# Altium schematic sheet ZIGBEE.SchDoc
size A3
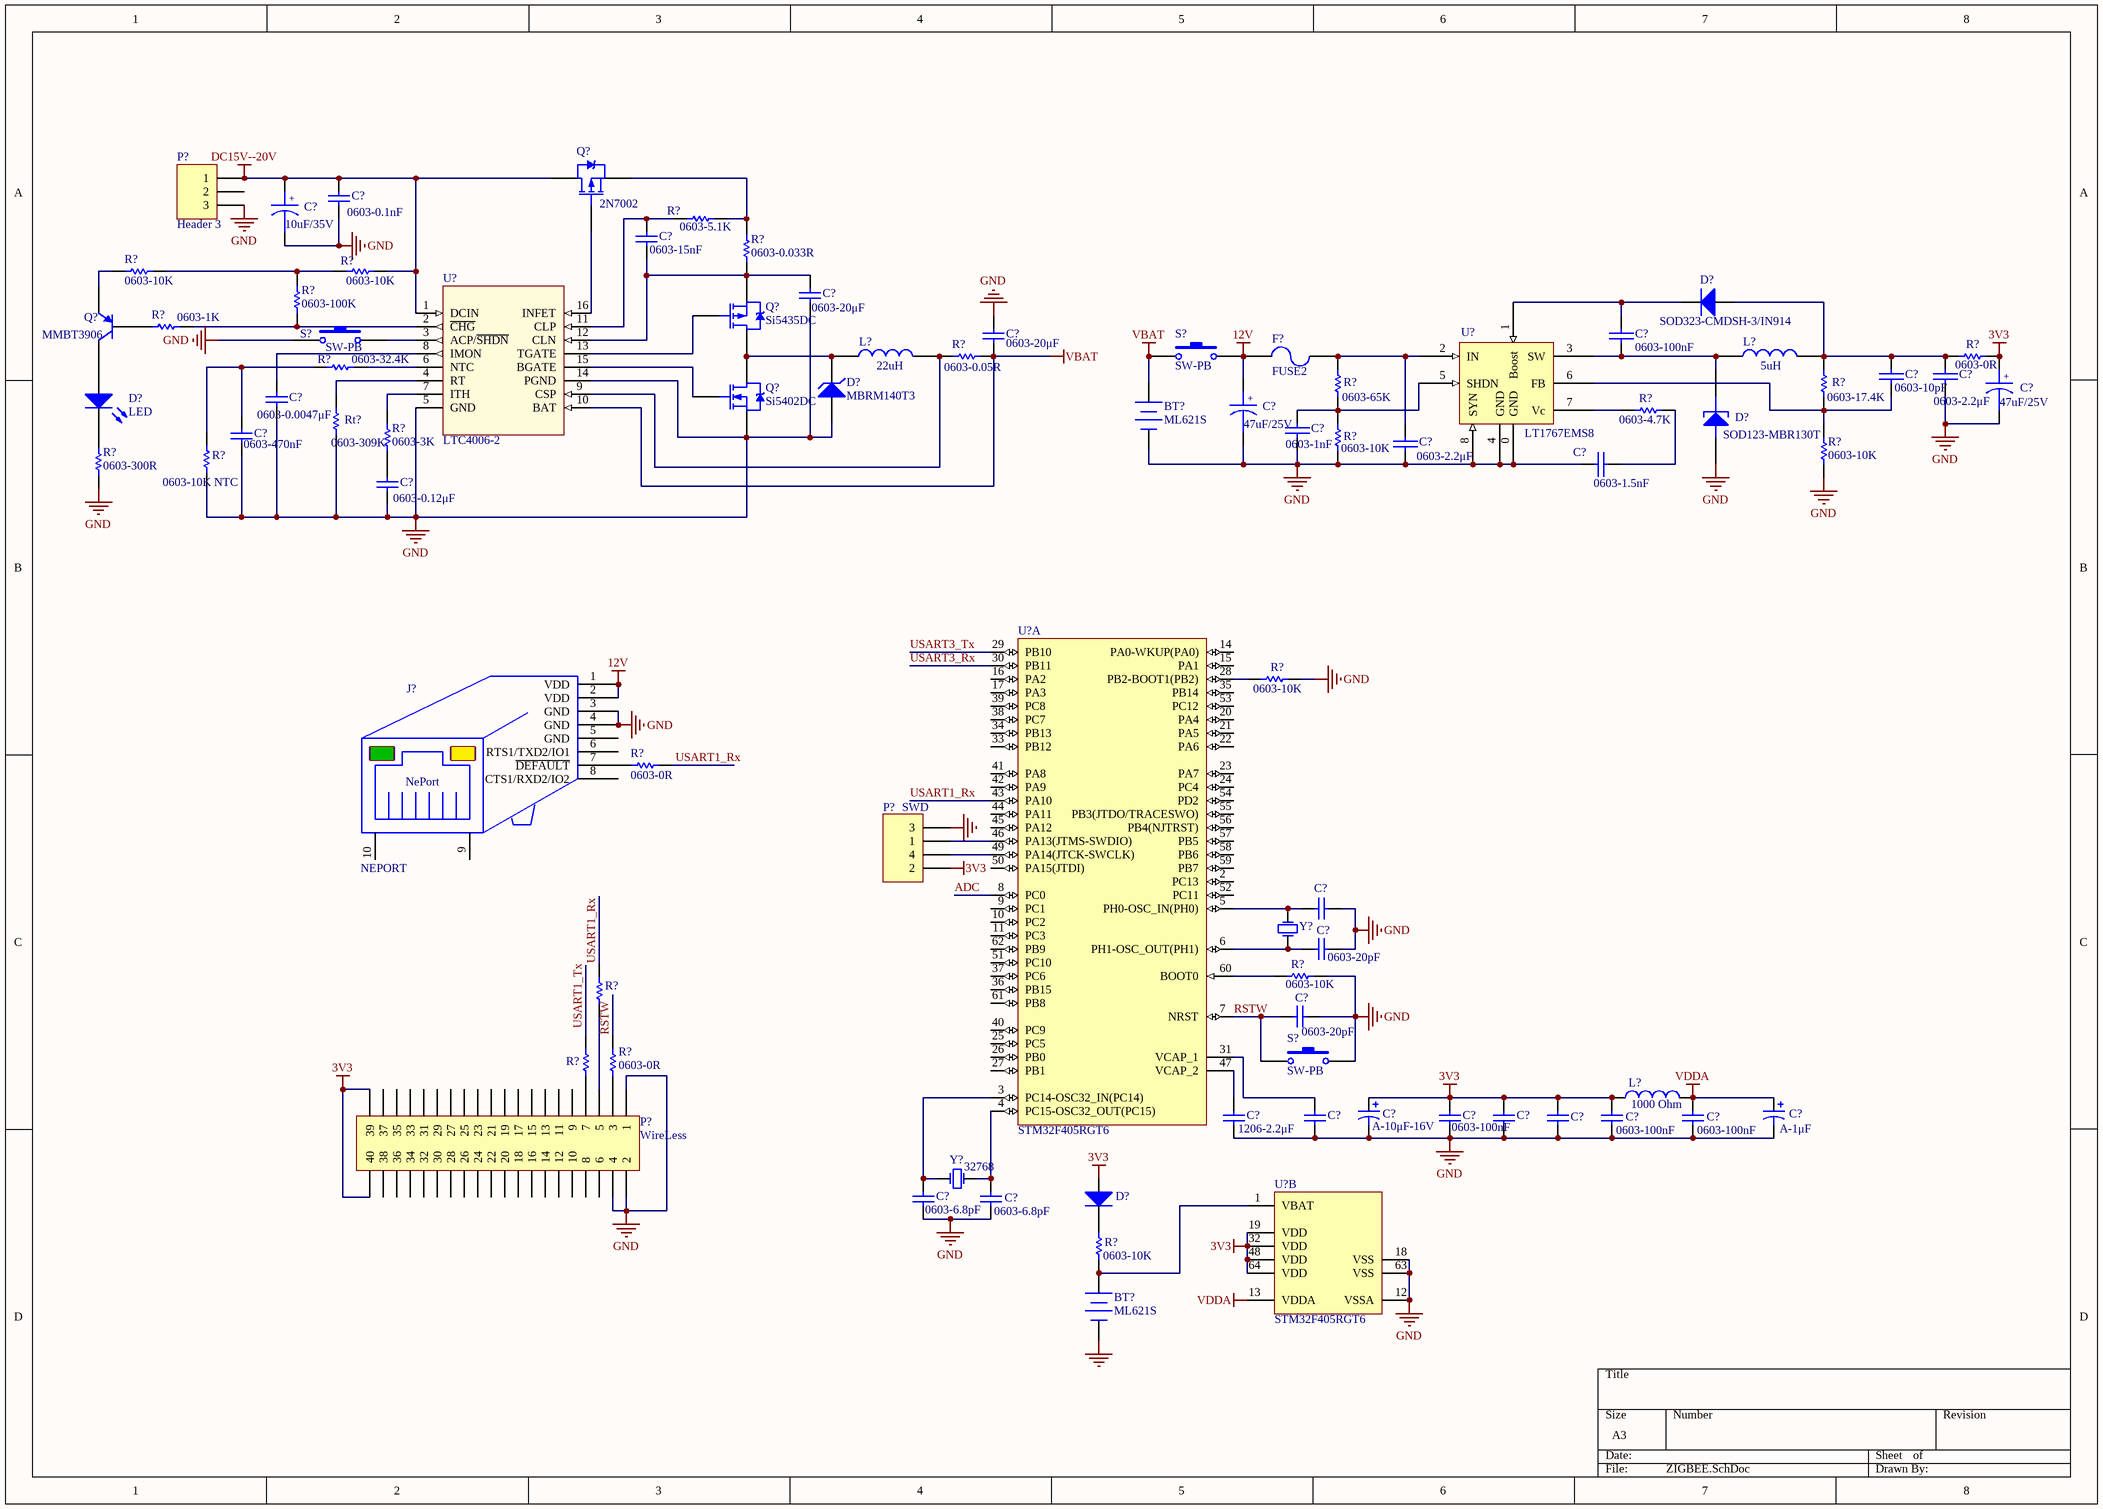
[diagram p0: ZIGBEE.SchDoc]

## Parts
(Parts that share a designator on the sheet are numbered #1, #2 ... from top to bottom, then left to right.)
BT?#1  ML621S  [ML621]
BT?#2  ML621S  [ML621]
C?#1  10uF/35V  [SMD-47uF/25V]
C?#2  0603-0.1nF  [0603C]
C?#3  0603-15nF  [0603C]
C?#4  0603-20μF  [0603C]
C?#5  0603-20μF  [0603C]
C?#6  0603-100nF  [0603C]
C?#7  0603-10pF  [0603C]
C?#8  0603-2.2μF  [0603C]
C?#9  47uF/25V  [SMD-47uF/25V]
C?#10  0603-0.0047μF  [0603C]
C?#11  47uF/25V  [SMD-47uF/25V]
C?#12  0603-1nF  [0603C]
C?#13  0603-470nF  [0603C]
C?#14  0603-2.2μF  [0603C]
C?#15  0603-0.12μF  [0603C]
C?#16  0603-1.5nF  [0603C]
C?#17  0603-20pF  [0603C]  (value not drawn)
C?#18  0603-20pF  [0603C]
C?#19  0603-20pF  [0603C]
C?#20  A-10μF-16V  [TANA]
C?#21  A-1μF  [TANA]
C?#22  1206-2.2μF  [1206C]
C?#23  1206-2.2μF  [1206C]  (value not drawn)
C?#24  0603-100nF  [0603C]
C?#25  0603-100nF  [0603C]  (value not drawn)
C?#26  0603-100nF  [0603C]  (value not drawn)
C?#27  0603-100nF  [0603C]
C?#28  0603-100nF  [0603C]
C?#29  0603-6.8pF  [0603C]
C?#30  0603-6.8pF  [0603C]
D?#1  SOD323-CMDSH-3/IN914  [SOD-323]
D?#2  LED  [LED-0]
D?#3  MBRM140T3  [DIODE-0.7]
D?#4  SOD123-MBR130T  [SOD123/X.85]
D?#5  1N4148  [SOD-80/MLL34]  (value not drawn)
F?  FUSE2  [0603]
J?  NEPORT  [RJ45_8P8C]
L?#1  22uH  [CDRH3D16]
L?#2  5uH  [CDRH3D16]
L?#3  1000 Ohm  [INDC4516AM]
P?#1  Header 3  [HDR1X3]
P?#2  SWD  [HDR1X4]
P?#3  WireLess  [SMALL/MIDDLE OEM MODEM]
Q?#1  2N7002  [TO-220AB]
Q?#2  MMBT3906  [TO-92A]
Q?#3  Si5435DC  [TO-220AB]
Q?#4  Si5402DC  [TO-220AB]
R?#1  0603-5.1K  [0603]
R?#2  0603-0.033R  [0603]
R?#3  0603-10K  [0603]
R?#4  0603-10K  [0603]
R?#5  0603-100K  [0603]
R?#6  0603-1K  [0603]
R?#7  0603-0.05R  [0603]
R?#8  0603-0R  [0603]
R?#9  0603-32.4K  [0603]
R?#10  0603-65K  [0603]
R?#11  0603-17.4K  [0603]
R?#12  0603-3K  [0603]
R?#13  0603-4.7K  [0603]
R?#14  0603-10K NTC  [0603]
R?#15  0603-10K  [0603]
R?#16  0603-10K  [0603]
R?#17  0603-300R  [0603]
R?#18  0603-10K  [0603]
R?#19  0603-0R  [0603]
R?#20  0603-10K  [0603]
R?#21  0603-0R  [0603]  (value not drawn)
R?#22  0603-0R  [0603]  (value not drawn)
R?#23  0603-0R  [0603]
R?#24  0603-10K  [0603]
Rt?  0603-309K  [0603]
S?#1  SW-PB  [SW3*4*2MM]
S?#2  SW-PB  [SW3*4*2MM]
S?#3  SW-PB  [SW3*4*2MM]
U?#1  LTC4006-2  [SSOP-16-M]
U?#2  LT1767EMS8  [MS8_N]
U?#3  STM32F405RGT6  [TQFP64_M]  (part A of 2)
U?#4  STM32F405RGT6  [TQFP64_M]  (part B of 2)
Y?#1  8MHz  [XTAL]  (value not drawn)
Y?#2  32768  [1206CY]

## Nets
3V3: C?#9.1 C?#20.1 C?#24.2 C?#25.2 C?#26.2 C?#27.2 D?#5.1(A) L?#3.1 P?#2.2 P?#3.39 P?#3.40 R?#8.2 U?#4.19(VDD) U?#4.32(VDD) U?#4.48(VDD) U?#4.64(VDD)
12V: C?#11.1 F?.1 J?.1(VDD) J?.2(VDD) S?#2.2
DC15V--20V: C?#1.1 C?#2.1 P?#1.1 Q?#1.2(D) R?#4.2 U?#1.1(DCIN)
GND: BT?#1.1(-) BT?#2.1(-) C?#1.2 C?#2.2 C?#4.2 C?#5.1 C?#8.2 C?#9.2 C?#10.2 C?#11.2 C?#12.2 C?#13.2 C?#14.2 C?#15.2 C?#16.1 C?#17.1 C?#18.1 C?#19.1 C?#20.2 C?#21.2 C?#22.1 C?#23.1 C?#24.1 C?#25.1 C?#26.1 C?#27.1 C?#28.1 C?#29.2 C?#30.2 D?#3.1(A) D?#4.1(A) J?.3(GND) J?.4(GND) P?#1.3 P?#2.3 P?#3.1 P?#3.2 P?#3.4 Q?#4.3(S) R?#14.2 R?#15.1 R?#16.1 R?#17.1 R?#18.2 R?#20.2 Rt?.2 S?#1.1 S?#3.2 U?#1.5(GND) U?#1.14(PGND) U?#2.0(GND) U?#2.4(GND) U?#2.8(SYN) U?#4.12(VSSA) U?#4.18(VSS) U?#4.63(VSS)
VBAT: BT?#1.2(+) C?#5.2 R?#7.2 S?#2.1 U?#1.10(BAT)
VDDA: C?#21.1 C?#28.2 L?#3.2 U?#4.13(VDDA)
ADC: U?#3.8(PC0)
RSTW: C?#19.2 R?#23.1 S?#3.1 U?#3.7(NRST)
USART1_Rx: R?#19.1 R?#21.1 U?#3.43(PA10)
USART1_Tx: R?#22.1
USART3_Rx: U?#3.30(PB11)
USART3_Tx: U?#3.29(PB10)
NetBT?#2_2: BT?#2.2(+) R?#24.2 U?#4.1(VBAT)
NetC?#3_1: C?#3.1 R?#1.2 U?#1.11(CLP)
NetC?#3_2: C?#3.2 C?#4.1 Q?#3.3(S) R?#2.2 U?#1.12(CLN)
NetC?#6_1: C?#6.1 D?#1.2(K) U?#2.1(Boost)
NetC?#6_2: C?#6.2 D?#4.2(K) L?#2.1 U?#2.3(SW)
NetC?#7_1: C?#7.1 C?#8.1 D?#1.1(A) L?#2.2 R?#8.1 R?#11.2
NetC?#7_2: C?#7.2 R?#11.1 R?#16.2 U?#2.6(FB)
NetC?#10_1: C?#10.1 U?#1.8(IMON)
NetC?#12_1: C?#12.1 R?#10.1 R?#15.2 U?#2.5(SHDN)
NetC?#13_1: C?#13.1 R?#9.2 R?#14.1
NetC?#14_1: C?#14.1 F?.2 R?#10.2 U?#2.2(IN)
NetC?#15_1: C?#15.1 R?#12.2
NetC?#16_2: C?#16.2 R?#13.1
NetC?#17_2: C?#17.2 U?#3.5(PH0-OSC_IN(PH0)) Y?#1.2(OSC2)
NetC?#18_2: C?#18.2 U?#3.6(PH1-OSC_OUT(PH1)) Y?#1.1(OSC1)
NetC?#22_2: C?#22.2 U?#3.47(VCAP_2)
NetC?#23_2: C?#23.2 U?#3.31(VCAP_1)
NetC?#29_1: C?#29.1 U?#3.3(PC14-OSC32_IN(PC14)) Y?#2.2(OSC2)
NetC?#30_1: C?#30.1 U?#3.4(PC15-OSC32_OUT(PC15)) Y?#2.1(OSC1)
NetD?#2_1: D?#2.1(A) Q?#2.3(C)
NetD?#2_2: D?#2.2(K) R?#17.2
NetD?#3_2: D?#3.2(K) L?#1.1 Q?#3.2(D) Q?#4.2(D)
NetD?#5_2: D?#5.2(K) R?#24.1
NetJ?_7: J?.7(~{DEFAULT}) R?#19.2
NetL?#1_2: L?#1.2 R?#7.1 U?#1.9(CSP)
NetP?#2_1: P?#2.1 U?#3.46(PA13(JTMS-SWDIO))
NetP?#2_4: P?#2.4 U?#3.49(PA14(JTCK-SWCLK))
NetP?#3_3: P?#3.3 R?#23.2
NetP?#3_5: P?#3.5 R?#21.2
NetP?#3_7: P?#3.7 R?#22.2
NetQ?#1_1: Q?#1.1(G) U?#1.16(INFET)
NetQ?#1_3: Q?#1.3(S) R?#1.1 R?#2.1
NetQ?#2_1: Q?#2.1(E) R?#3.1
NetQ?#2_2: Q?#2.2(B) R?#6.1
NetQ?#3_1: Q?#3.1(G) U?#1.13(TGATE)
NetQ?#4_1: Q?#4.1(G) U?#1.15(BGATE)
NetR?#3_2: R?#3.2 R?#4.1 R?#5.1
NetR?#5_2: R?#5.2 R?#6.2 U?#1.2(~{CHG})
NetR?#9_1: R?#9.1 U?#1.6(NTC)
NetR?#12_1: R?#12.1 U?#1.7(ITH)
NetR?#13_2: R?#13.2 U?#2.7(Vc)
NetR?#18_1: R?#18.1 U?#3.28(PB2-BOOT1(PB2))
NetR?#20_1: R?#20.1 U?#3.60(BOOT0)
NetRt?_1: Rt?.1 U?#1.4(RT)
NetS?#1_2: S?#1.2 U?#1.3(ACP/~{SHDN})

Not connected (* = marked no-connect by the designer): J? 5(GND) 6(RTS1/TXD2/IO1) 8(CTS1/RXD2/IO2) 9(SHELL) 10(SHELL); P?#1 2; P?#3 6 8 9 10 11 12 13 14 15 16 17 18 19 20 21 22 23 24 25 26 27 28 29 30 31 32 33 34 35 36 37 38; U?#3 2(PC13) 9(PC1) 10(PC2) 11(PC3) 14(PA0-WKUP(PA0)) 15(PA1) 16(PA2) 17(PA3) 20(PA4) 21(PA5) 22(PA6) 23(PA7) 24(PC4) 25(PC5) 26(PB0) 27(PB1) 33(PB12) 34(PB13) 35(PB14) 36(PB15) 37(PC6) 38(PC7) 39(PC8) 40(PC9) 41(PA8) 42(PA9) 44(PA11) 45(PA12) 50(PA15(JTDI)) 51(PC10) 52(PC11) 53(PC12) 54(PD2) 55(PB3(JTDO/TRACESWO)) 56(PB4(NJTRST)) 57(PB5) 58(PB6) 59(PB7) 61(PB8) 62(PB9)

## Notes on the sheet
- (in symbol NEPORT) NePort
- (in symbol 电解电容) +

## Library data of the parts
BT?#1 BT?#2 = Battery: Multicell Battery; Published: 24-Mar-1999; LatestRevisionDate: 17-Jul-2002; LatestRevisionNote: Re-released for DXP Platform.; PackageReference: BAT-2; Publisher: Altium Limited
C?#1 C?#9 C?#11 = 电解电容: Capacitor
C?#2-C?#5 C?#10 C?#13 C?#15 C?#17-C?#19 C?#22-C?#30 = Cap: Capacitor; Published: 8-Jun-2000; LatestRevisionDate: 17-Jul-2002; LatestRevisionNote: Re-released for DXP Platform.; PackageReference: RAD-0.3; Publisher: Altium Limited; PackageDescription: Radial Cap, Thru-Hole; 2 Leads; 0.3 in Pin Spacing
  C?#2: Value: 0603-0.1nF
  C?#3: Value: 0603-15nF
  C?#4 C?#5: Value: 0603-20μF
  C?#10: Value: 0603-0.0047μF
  C?#13: Value: 0603-470nF
  C?#15: Value: 0603-0.12μF
  C?#17-C?#19: Value: 0603-20pF
  C?#22 C?#23: Value: 1206-2.2μF
  C?#24-C?#28: Value: 0603-100nF
  C?#29 C?#30: Value: 0603-6.8pF
C?#6-C?#8 C?#12 C?#14 C?#16 = 普通电容: Capacitor
C?#20 = Cap Pol1: Polarized Capacitor (Radial); Published: 8-Jun-2000; LatestRevisionDate: 17-Jul-2002; LatestRevisionNote: Re-released for DXP Platform.; PackageReference: RB7.6-15; Publisher: Altium Limited; PackageDescription: Polarized Capacitor (Radial); 2 Leads; Value: A-10μF-16V
C?#21 = Cap Pol1: Polarized Capacitor (Radial); Value: 1μF; Published: 8-Jun-2000; LatestRevisionDate: 17-Jul-2002; LatestRevisionNote: Re-released for DXP Platform.; PackageReference: RB7.6-15; Publisher: Altium Limited; PackageDescription: Polarized Capacitor (Radial); 2 Leads
D?#1 = DIODE
D?#2 = LED0: Typical INFRARED GaAs LED; Published: 8-Jun-2000; LatestRevisionDate: 08-Jul-2005; LatestRevisionNote: Mech Layer 1 removed.; PackageReference: LED-0; Publisher: Altium Limited
D?#3 = D Zener: Zener Diode; Published: 8-Jun-2000; LatestRevisionDate: 17-Jul-2002; LatestRevisionNote: Re-released for DXP Platform.; PackageReference: DIODE-0.7; Publisher: Altium Limited
D?#4 = TUNNEL: Tunnel FDiode
D?#5 = Diode 1N4148: High Conductance Fast Diode; Published: 8-Jun-2000; LatestRevisionDate: 17-Jul-2002; LatestRevisionNote: Re-released for DXP Platform.; DatasheetVersion: 1997; PackageReference: DO-35; Publisher: Altium Limited; PackageDescription: Diode, Axial; Body 3.8 x 1.9 mm (LxDia. max), Lead Dia. 0.53 mm (max); Code_JEDEC: DO-204-AH; ComponentLink1Description: Manufacturer Link; ComponentLink1URL: http://www.fairchildsemi.com/; ComponentLink2Description: Datasheet; ComponentLink2URL: http://www.fairchildsemi.com/ds/1N%2F1N4148.pdf
F? = FUSE2: Fuse
J? = NEPORT: serial to ethernet RJ45 jack
L?#1 L?#2 = INDUCTOR
L?#3 = Inductor: BLM41PG102SN1L\CBW451616U900; Code_IEC: 1005; Published: 8-Jun-2000; LatestRevisionDate: 29-May-2009; LatestRevisionNote: IPC-7351 Footprint Added.; PackageReference: 0402-A; Publisher: Altium Limited; PackageDescription: Chip Inductor; Code_JEITA: 0402; Value: 1000 Ohm
P?#1 = Header 3: Header, 3-Pin; LatestRevisionDate: 17-Jul-2002; LatestRevisionNote: Re-released for DXP Platform.; Publisher: Altium Limited
P?#2 = Header 4: Header, 4-Pin; LatestRevisionDate: 17-Jul-2002; LatestRevisionNote: Re-released for DXP Platform.; Publisher: Altium Limited
P?#3 = Header 20X2: Header, 20-Pin, Dual row; LatestRevisionDate: 17-Jul-2002; LatestRevisionNote: Re-released for DXP Platform.; Publisher: Altium Limited
Q?#1 Q?#3 = PMOS-2: P-Channel Power MOSFET; Note: Pin 4 not drawn and electrically connected to Pin 2.; Published: 8-Jun-2000; LatestRevisionDate: 17-Jul-2002; LatestRevisionNote: Re-released for DXP Platform.; DatasheetDocument: PD-9.390D; PackageReference: TO-220AB; Publisher: Altium Limited; Code_JEDEC: TO-220-AB; ComponentLink1Description: Manufacturer Link; ComponentLink1URL: http://www.irf.com/
Q?#2 = 2N3906: PNP General Purpose Amplifier; Published: 8-Jun-2000; LatestRevisionDate: 15-Jan-2003; LatestRevisionNote: PCB Footprint 'BCY-W3/D4.7' replaced; DatasheetDocument: 1997; PackageDocument: Sep-1998; PackageReference: TO-92A; Publisher: Altium Limited; Code_JEDEC: TO-92A; ComponentLink1Description: Manufacturer Link; ComponentLink1URL: http://www.fairchildsemi.com/; ComponentLink2Description: Datasheet; ComponentLink2URL: http://www.fairchildsemi.com/ds/2N%2F2N3906.pdf
Q?#4 = NMOS-2: N-Channel Power MOSFET; Note: Pin 2 is electrically connected to pin 4.; Published: 8-Jun-2000; LatestRevisionDate: 17-Jul-2002; LatestRevisionNote: Re-released for DXP Platform.; DatasheetDocument: PD-9.814; PackageReference: TO-220AB; Publisher: Altium Limited; Code_JEDEC: TO-220-AB; ComponentLink1Description: Manufacturer Link; ComponentLink1URL: http://www.irf.com/
R?#1-R?#6 R?#9 R?#12 R?#14 R?#19 R?#21-R?#23 Rt? = Res1: Resistor; Rule: PcbType=ProtelPcb; Published: 8-Jun-2000; LatestRevisionDate: 17-Jul-2002; LatestRevisionNote: Re-released for DXP Platform.; PackageReference: AXIAL-0.3; Publisher: Altium Limited; PackageDescription: Axial Device, Thru-Hole; 2 Leads; 0.3 in Pin Spacing
  R?#1: Value: 0603-5.1K
  R?#2: Value: 0603-0.033R
  R?#3 R?#4 R?#14: Value: 0603-10K
  R?#5: Value: 0603-100K
  R?#6: Value: 0603-1K
  R?#9: Value: 0603-32.4K
  R?#12: Value: 0603-3K
  R?#19 R?#21-R?#23: Value: 0603-0R
  Rt?: Value: 0603-309K
R?#7 = Res1: Resistor; Value: 0603-0.025R; Rule: PcbType=ProtelPcb; Published: 8-Jun-2000; LatestRevisionDate: 17-Jul-2002; LatestRevisionNote: Re-released for DXP Platform.; PackageReference: AXIAL-0.3; Publisher: Altium Limited; PackageDescription: Axial Device, Thru-Hole; 2 Leads; 0.3 in Pin Spacing
R?#8 R?#10 R?#11 R?#13 R?#15 R?#16 R?#18 R?#20 R?#24 = Res1: Resistor; Published: 8-Jun-2000; LatestRevisionDate: 17-Jul-2002; LatestRevisionNote: Re-released for DXP Platform.; PackageReference: AXIAL-0.3; Publisher: Altium Limited; PackageDescription: Axial Device, Thru-Hole; 2 Leads; 0.3 in Pin Spacing
  R?#8: Value: 0603-0R
  R?#10: Value: 0603-65K
  R?#11: Value: 0603-17.4K
  R?#13: Value: 0603-4.7K
  R?#15 R?#16 R?#18 R?#20 R?#24: Value: 0603-10K
R?#17 = Res1: Resistor; Value: 0603-100K; Rule: PcbType=ProtelPcb; Published: 8-Jun-2000; LatestRevisionDate: 17-Jul-2002; LatestRevisionNote: Re-released for DXP Platform.; PackageReference: AXIAL-0.3; Publisher: Altium Limited; PackageDescription: Axial Device, Thru-Hole; 2 Leads; 0.3 in Pin Spacing
S?#1-S?#3 = SW-PB: Switch; Published: 24-Mar-1999; LatestRevisionDate: 17-Jul-2002; LatestRevisionNote: Re-released for DXP Platform.; PackageReference: SPST-2; Publisher: Altium Limited
U?#1 = LTC4006
U?#3 U?#4 = STM32F405RGT6: ARM Cortex-M4 32-bit MCU+FPU, 210 DMIPS, 1024 kB Flash, 192 kB Internal RAM, 51 I/Os, 64-pin LQFP, -40 to 85 degC, Tray; Manufacturer: STMicroelectronics; D/A Converter: 2x12-bit; FLASH Size (Prog) (kB): 1024; I/Os (High Current): 51; Internal RAM Size (kB): 192; Operating Frequency(F) (Processor speed) (MHz): 168; Supply Voltage(Vcc) max (V): 3.6; Supply Voltage(Vcc) min (V): 1.8; DatasheetVersion: Rev. 4; PackageVersion: Rev. 4, 06/2013; PackageReference: LQFP64; PackageDescription: 64-Pin Low Profile Quad Flat Package, 10 x 10 mm Body, 0.5 mm Pitch; Supplier 1: Digi-Key; Supplier Part Number 1: 497-11767-ND; Supplier 2: Farnell; Supplier Part Number 2: 2064363; Supplier 3: Newark; Supplier Part Number 3: 73T2329; Supplier 4: Mouser; Supplier Part Number 4: 511-STM32F405RGT6; Core: ARM Cortex-M4; Packing: Tray; Mounting Technology: Surface Mount; PartNumber: STM32F405RGT6; ComponentLink1Description: Manufacturer URL; ComponentLink1URL: http://www.st.com/web/en/home.html; ComponentLink2Description: Datasheet; ComponentLink2URL: http://www.st.com/st-web-ui/static/active/en/resource/technical/document/datasheet/DM00037051.pdf; ComponentLink3Description: Package Specification; ComponentLink3URL: http://www.st.com/st-web-ui/static/active/en/resource/technical/document/datasheet/DM00037051.pdf
Y?#1 Y?#2 = XTAL: Crystal Oscillator; Published: 8-Jun-2000; LatestRevisionDate: 17-Jul-2002; LatestRevisionNote: Re-released for DXP Platform.; PackageReference: R38; Publisher: Altium Limited; PackageDescription: Crystal, Thru-Hole; 2 Leads; Body 3.1 x 8.2 mm (Dia.xH)